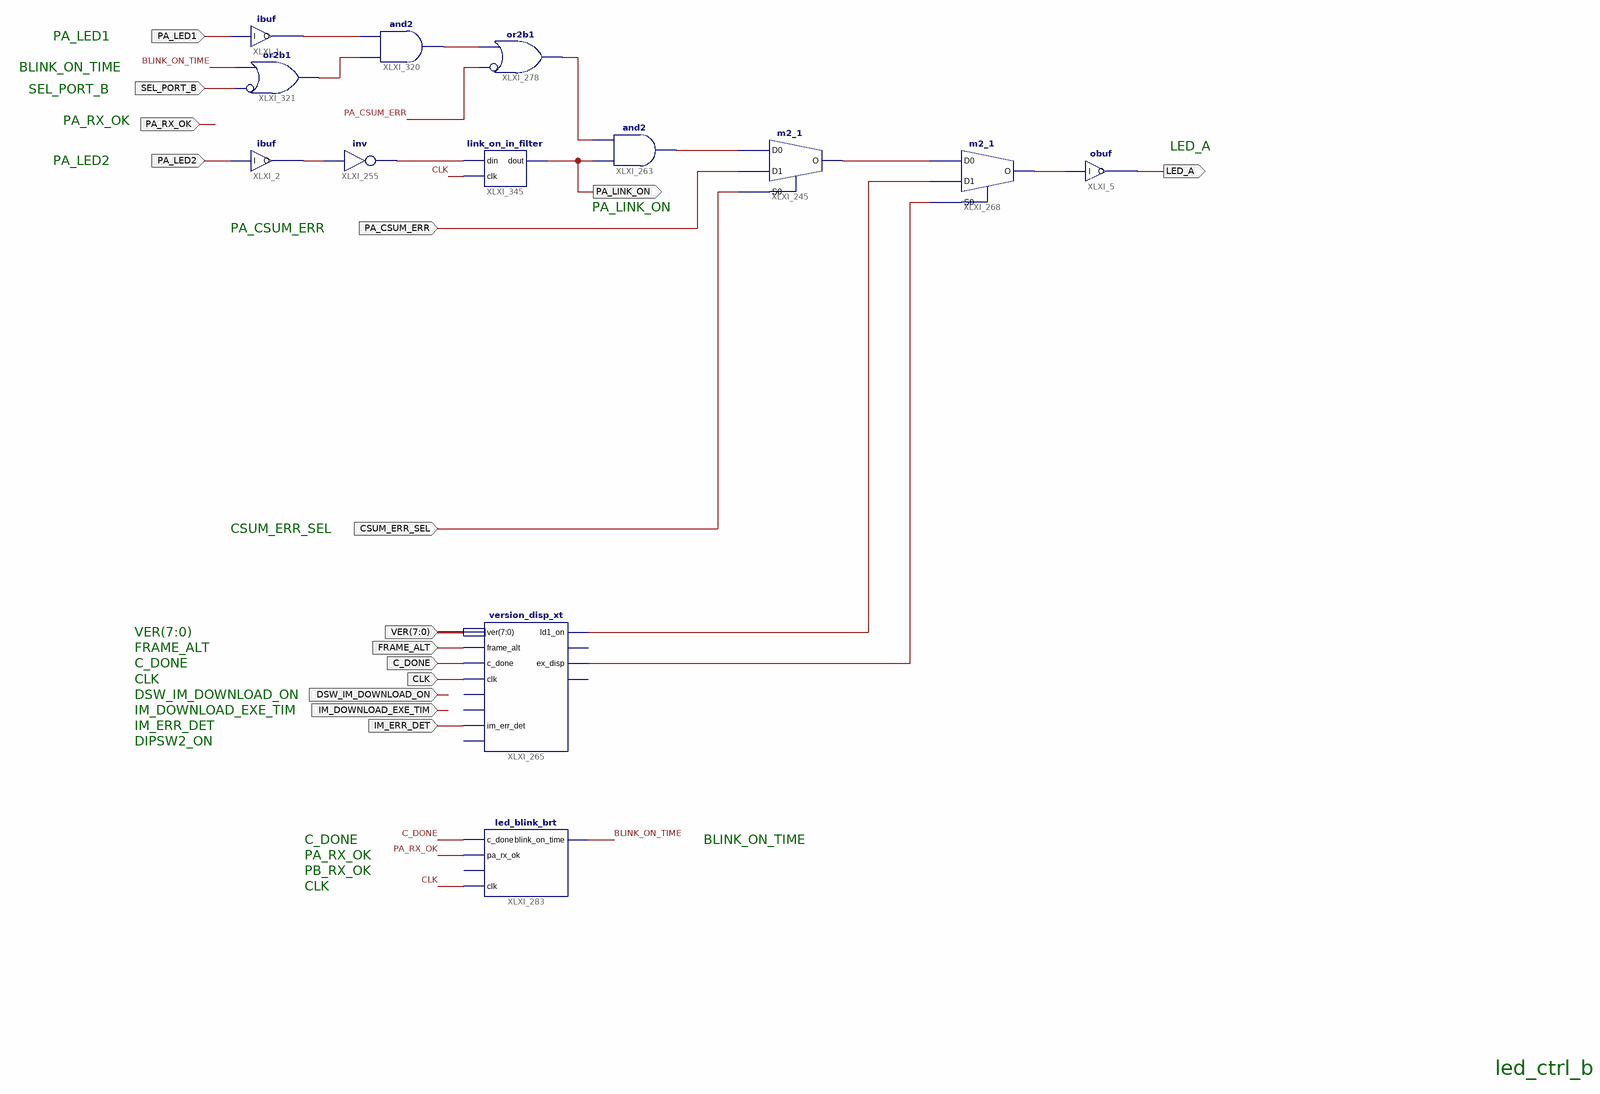
[diagram p0: schematic sheet 1]
// Xilinx ISE schematic led_ctrl_b.sch (aspartan6) as structural Verilog: 13 symbols, 15 ports
module led_ctrl_b (
  input  DSW_IM_DOWNLOAD_ON,
  input  IM_DOWNLOAD_EXE_TIM,
  input  IM_ERR_DET,
  input  CLK,
  input  C_DONE,
  input  FRAME_ALT,
  input  [7:0] VER,
  input  CSUM_ERR_SEL,
  input  PA_RX_OK,
  input  PA_CSUM_ERR,
  input  SEL_PORT_B,
  input  PA_LED1,
  input  PA_LED2,
  output PA_LINK_ON,
  output LED_A
);

  wire BLINK_ON_TIME, XLXN_561, XLXN_595, XLXN_657, XLXN_658, XLXN_664, XLXN_685, XLXN_795, XLXN_796,
       XLXN_800, XLXN_802, XLXN_848;

  version_disp_xt XLXI_265 (
    .frame_alt(FRAME_ALT), .c_done(C_DONE), .clk(CLK), .ver(VER), .ex_disp(XLXN_657), .ld1_on(XLXN_802),
    .im_err_det(IM_ERR_DET));  // open: dsw_im_download_on, im_download_exe_tim, ver_disp, ld2_on, dipsw2_on
  led_blink_brt XLXI_283 (
    .c_done(C_DONE), .blink_on_time(BLINK_ON_TIME), .pa_rx_ok(PA_RX_OK), .clk(CLK));  // open: pb_rx_ok
  m2_1 XLXI_245 (.D0(XLXN_561), .D1(PA_CSUM_ERR), .S0(CSUM_ERR_SEL), .O(XLXN_658));
  and XLXI_263 (XLXN_561, PA_LINK_ON, XLXN_685);
  m2_1 XLXI_268 (.D0(XLXN_658), .D1(XLXN_802), .S0(XLXN_657), .O(XLXN_664));
  obuf XLXI_5 (.I(XLXN_664), .O(LED_A));
  and XLXI_320 (XLXN_795, XLXN_796, XLXN_800);
  or XLXI_321 (XLXN_796, ~SEL_PORT_B, BLINK_ON_TIME);  // or2b1
  or XLXI_278 (XLXN_685, ~PA_CSUM_ERR, XLXN_795);  // or2b1
  ibuf XLXI_1 (.I(PA_LED1), .O(XLXN_800));
  link_on_in_filter XLXI_345 (.din(XLXN_848), .clk(CLK), .dout(PA_LINK_ON));
  ibuf XLXI_2 (.I(PA_LED2), .O(XLXN_595));
  not XLXI_255 (XLXN_848, XLXN_595);

  // Notes on the sheet:
  //   PA_LED1
  //   BLINK_ON_TIME
  //   SEL_PORT_B
  //   PA_RX_OK
  //   LED_A
  //   PA_LED2
  //   PA_LINK_ON
  //   PA_CSUM_ERR
  //   CSUM_ERR_SEL
  //   VER(7:0)
  //   FRAME_ALT
  //   C_DONE
  //   CLK
  //   DSW_IM_DOWNLOAD_ON
  //   IM_DOWNLOAD_EXE_TIM
  //   IM_ERR_DET
  //   DIPSW2_ON
  //   C_DONE
  //   BLINK_ON_TIME
  //   PA_RX_OK
  //   PB_RX_OK
  //   CLK
  //   led_ctrl_b
endmodule
